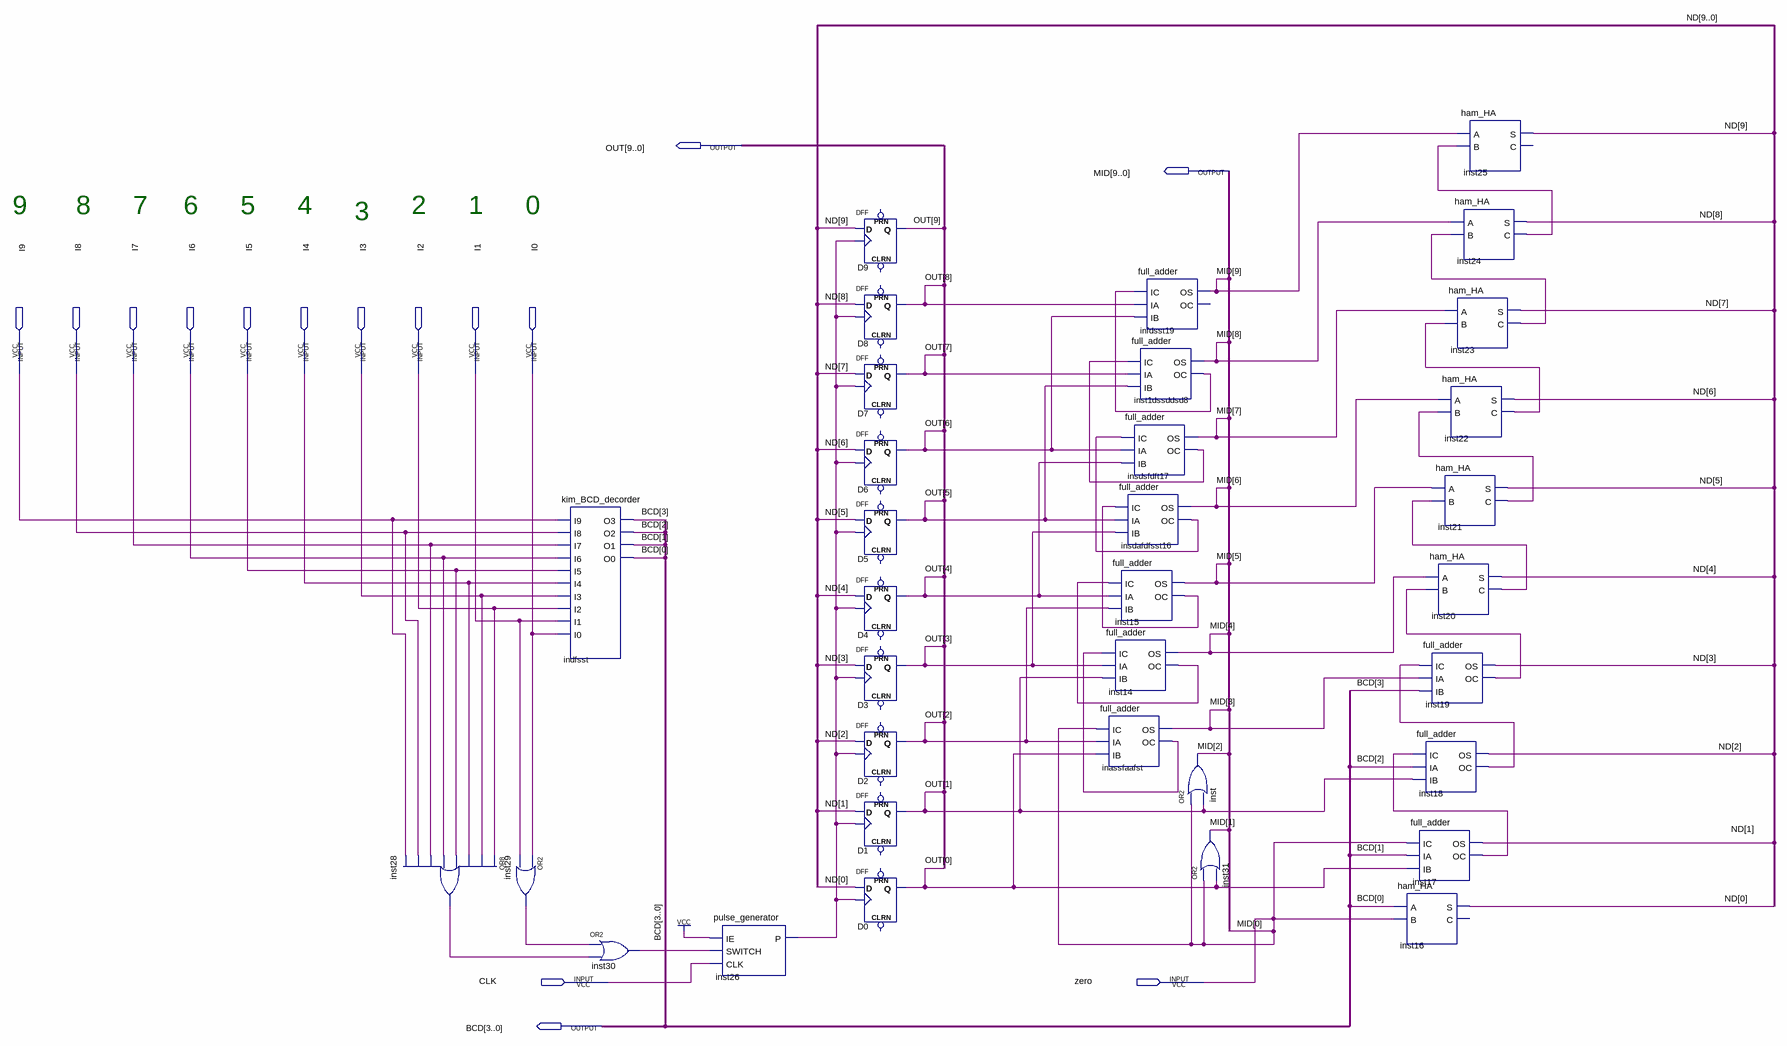
[diagram p0: schematic sheet]
// Quartus schematic Test.bdf as structural Verilog: 34 symbols, 15 pins
module Test (
  input  I9,
  input  I8,
  input  I7,
  input  I6,
  input  I5,
  input  I4,
  input  I3,
  input  I2,
  input  I1,
  input  I0,
  input  CLK,
  input  zero,
  output [9:0] OUT,
  output [9:0] MID,
  output [3:0] BCD
);

  wire inassfaafst_oc, insdafdfsst16_oc, insdsfdft17_oc, inst1dssddsd8_oc, inst14_oc, inst15_oc, inst17_oc,
       inst18_oc, inst19_oc, inst20_c, inst21_c, inst22_c, inst23_c, inst24_c, inst26_p, inst28_out,
       inst29_out, inst30_out;
  wire [9:0] ND;

  or inst28 (inst28_out, I2, I3, I4, I5, I6, I7, I8, I9);
  or inst29 (inst29_out, I0, I1);
  kim_BCD_decorder indfsst (
    .I9(I9), .I8(I8), .I7(I7), .I6(I6), .I5(I5), .I4(I4), .I3(I3), .I2(I2), .I1(I1), .I0(I0), .O3(BCD[3]),
    .O2(BCD[2]), .O1(BCD[1]), .O0(BCD[0]));
  or inst30 (inst30_out, inst29_out, inst28_out);
  pulse_generator inst26 (.IE(1'b1), .SWITCH(inst30_out), .CLK(CLK), .P(inst26_p));
  DFF D9 (.CLK(inst26_p), .D(ND[9]), .Q(OUT[9]));  // open: CLRN, PRN
  DFF D8 (.CLK(inst26_p), .D(ND[8]), .Q(OUT[8]));  // open: CLRN, PRN
  DFF D7 (.CLK(inst26_p), .D(ND[7]), .Q(OUT[7]));  // open: CLRN, PRN
  DFF D6 (.CLK(inst26_p), .D(ND[6]), .Q(OUT[6]));  // open: CLRN, PRN
  DFF D5 (.CLK(inst26_p), .D(ND[5]), .Q(OUT[5]));  // open: CLRN, PRN
  DFF D4 (.CLK(inst26_p), .D(ND[4]), .Q(OUT[4]));  // open: CLRN, PRN
  DFF D3 (.CLK(inst26_p), .D(ND[3]), .Q(OUT[3]));  // open: CLRN, PRN
  DFF D2 (.CLK(inst26_p), .D(ND[2]), .Q(OUT[2]));  // open: CLRN, PRN
  DFF D1 (.CLK(inst26_p), .D(ND[1]), .Q(OUT[1]));  // open: CLRN, PRN
  DFF D0 (.CLK(inst26_p), .D(ND[0]), .Q(OUT[0]));  // open: CLRN, PRN
  full_adder inst1dssddsd8 (.IC(insdsfdft17_oc), .IA(OUT[7]), .IB(OUT[5]), .OS(MID[8]), .OC(inst1dssddsd8_oc));
  full_adder insdsfdft17 (.IC(insdafdfsst16_oc), .IA(OUT[6]), .IB(OUT[4]), .OS(MID[7]), .OC(insdsfdft17_oc));
  full_adder insdafdfsst16 (.IC(inst15_oc), .IA(OUT[5]), .IB(OUT[3]), .OS(MID[6]), .OC(insdafdfsst16_oc));
  full_adder inst15 (.IC(inst14_oc), .IA(OUT[4]), .IB(OUT[2]), .OS(MID[5]), .OC(inst15_oc));
  full_adder inst14 (.IC(inassfaafst_oc), .IA(OUT[3]), .IB(OUT[1]), .OS(MID[4]), .OC(inst14_oc));
  full_adder inassfaafst (.IC(zero), .IA(OUT[2]), .IB(OUT[0]), .OS(MID[3]), .OC(inassfaafst_oc));
  full_adder infdsst19 (.IC(inst1dssddsd8_oc), .IA(OUT[8]), .IB(OUT[6]), .OS(MID[9]));  // open: OC
  or inst (MID[2], zero, OUT[1]);
  or inst31 (MID[1], zero, OUT[0]);
  ham_HA inst21 (.A(MID[5]), .B(inst20_c), .S(ND[5]), .C(inst21_c));
  ham_HA inst20 (.A(MID[4]), .B(inst19_oc), .S(ND[4]), .C(inst20_c));
  full_adder inst19 (.IC(inst18_oc), .IA(MID[3]), .IB(BCD[3]), .OS(ND[3]), .OC(inst19_oc));
  full_adder inst18 (.IC(inst17_oc), .IA(BCD[2]), .IB(OUT[1]), .OS(ND[2]), .OC(inst18_oc));
  full_adder inst17 (.IC(zero), .IA(BCD[1]), .IB(OUT[0]), .OS(ND[1]), .OC(inst17_oc));
  ham_HA inst16 (.A(BCD[0]), .B(zero), .S(ND[0]));  // open: C
  ham_HA inst25 (.A(MID[9]), .B(inst24_c), .S(ND[9]));  // open: C
  ham_HA inst24 (.A(MID[8]), .B(inst23_c), .S(ND[8]), .C(inst24_c));
  ham_HA inst23 (.A(MID[7]), .B(inst22_c), .S(ND[7]), .C(inst23_c));
  ham_HA inst22 (.A(MID[6]), .B(inst21_c), .S(ND[6]), .C(inst22_c));

  assign MID[0] = zero;

  // Notes on the sheet:
  //   9
  //   8
  //   7
  //   6
  //   5
  //   4
  //   2
  //   1
  //   0
  //   3
endmodule
